# EAGLE design CrackberryPi_1.0.6.2_kb (EAGLE 7.2.0)
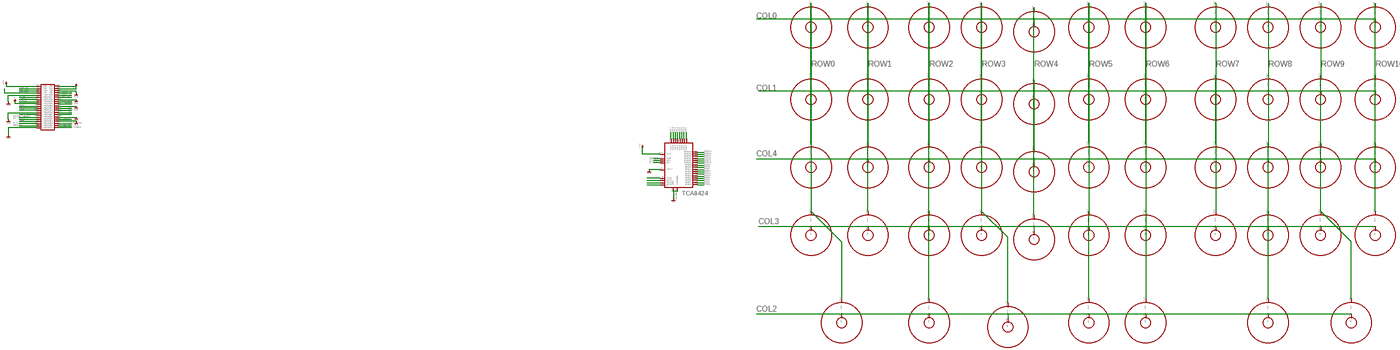
[diagram p0: schematic, sheet 1, overview]
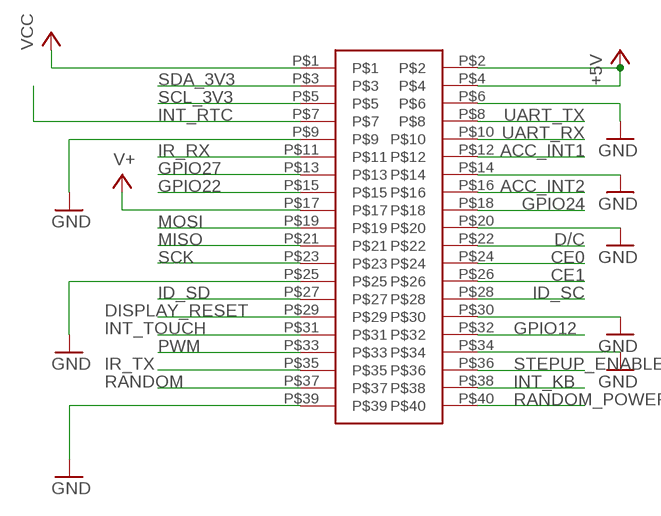
[diagram p1: schematic, sheet 1, part 1 of 4]
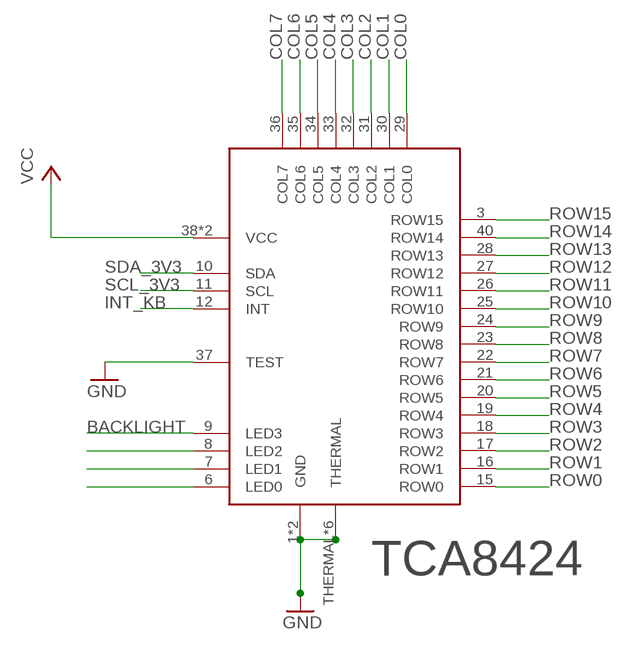
[diagram p2: schematic, sheet 1, part 2 of 4]
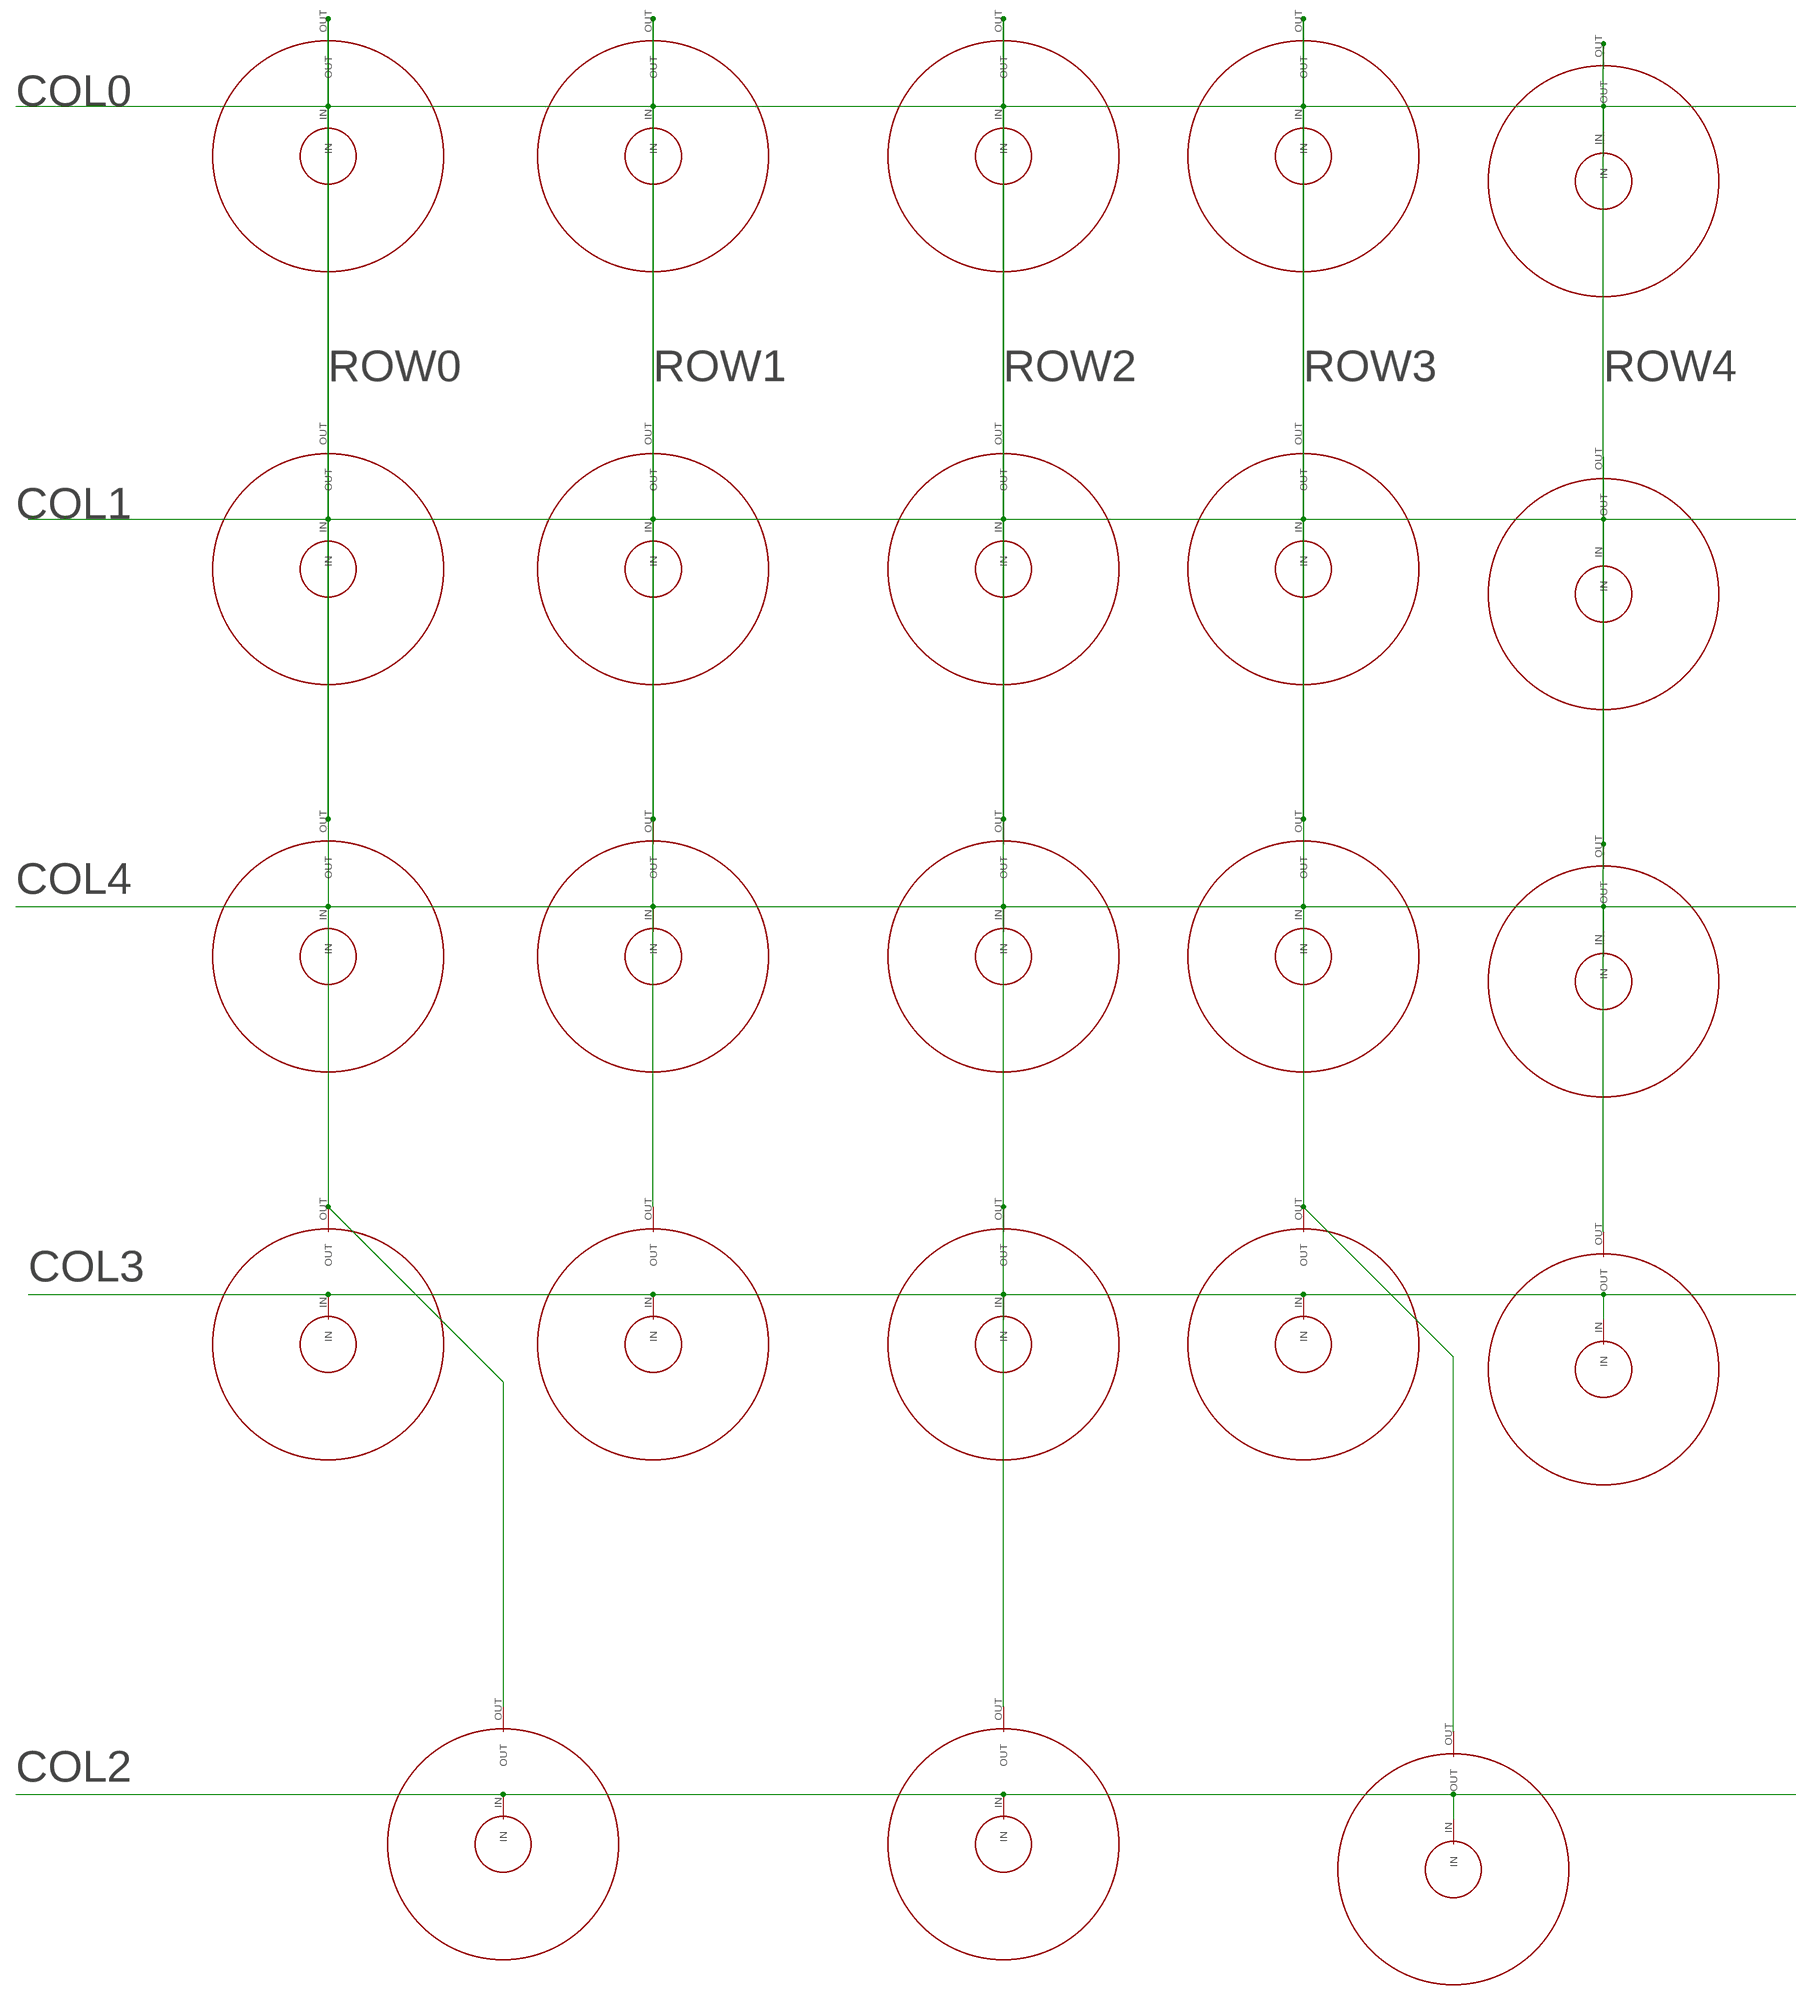
[diagram p3: schematic, sheet 1, part 3 of 4]
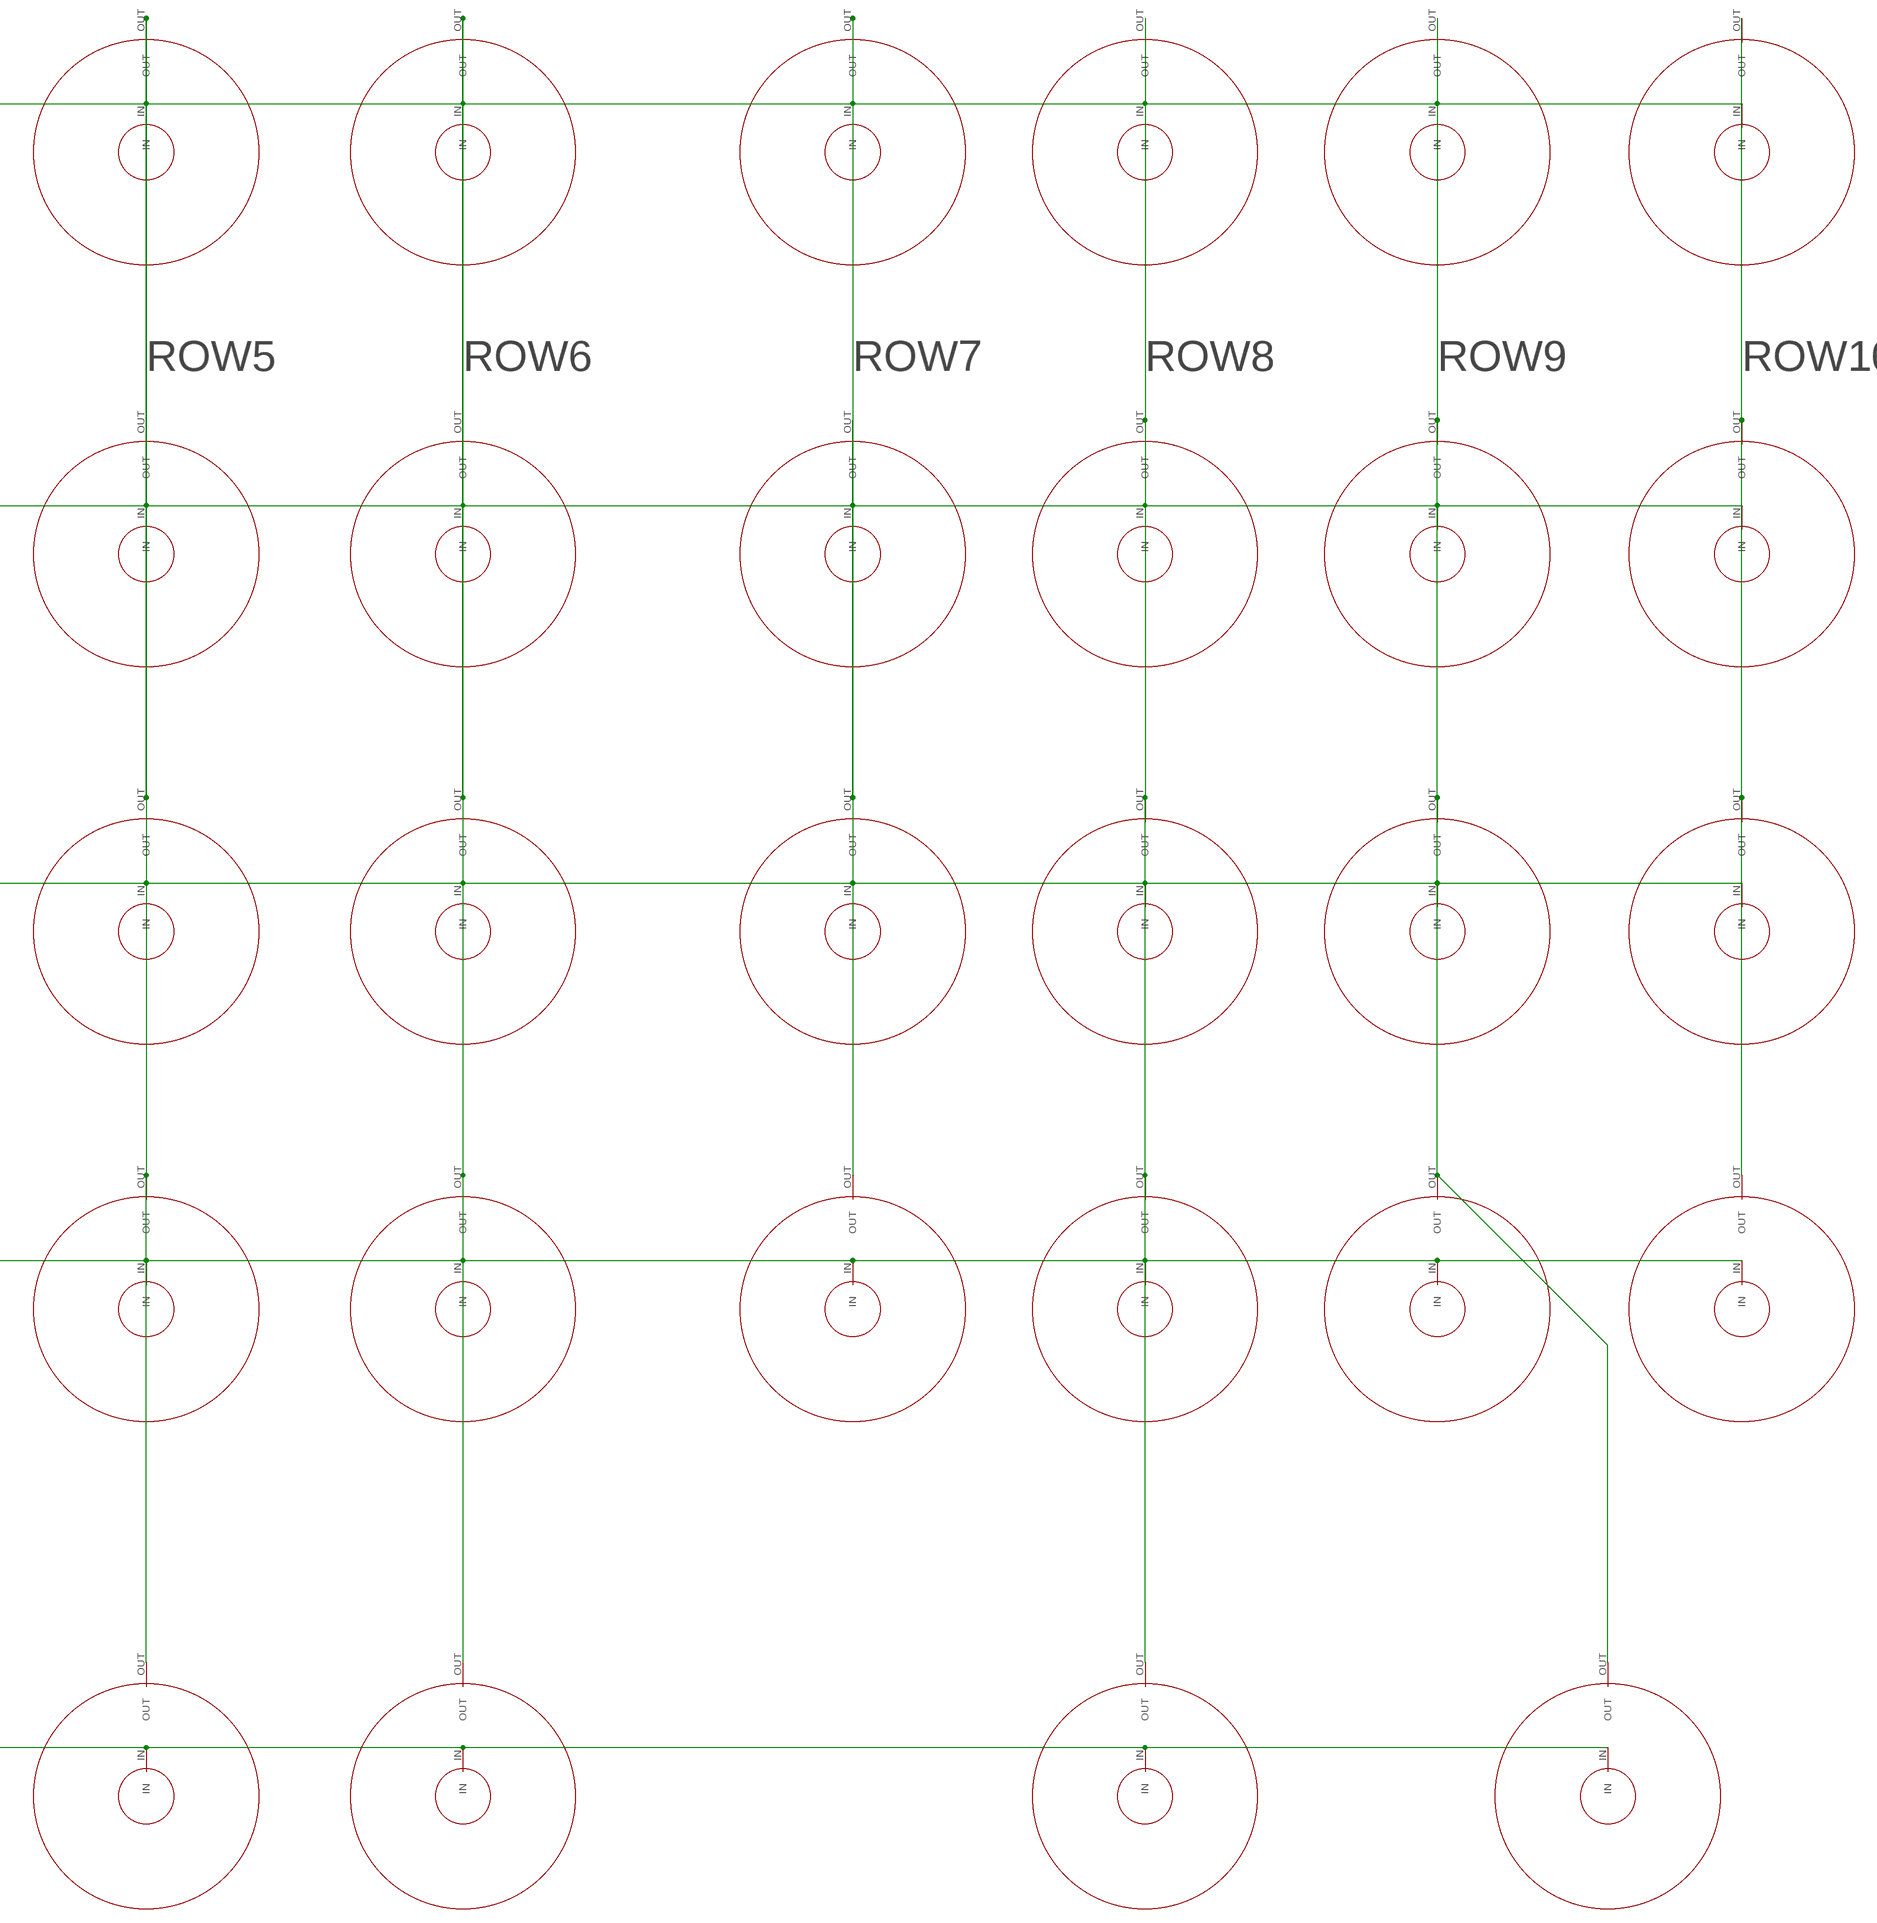
[diagram p4: schematic, sheet 1, part 4 of 4]

## Parts
1  DOME  [4MM]
2  DOME  [4MM]
3  DOME  [4MM]
4  DOME  [4MM]
5  DOME  [4MM]
6  DOME  [4MM]
7  DOME  [4MM]
8  DOME  [4MM]
9  DOME  [4MM]
10  DOME  [4MM]
11  DOME  [4MM]
12  DOME  [4MM]
!  DOME  [4MM]
(  DOME  [4MM]
)  DOME  [4MM]
,  DOME  [4MM]
.  DOME  [4MM]
?  DOME  [4MM]
@  DOME  [4MM]
A  DOME  [4MM]
B  DOME  [4MM]
C  DOME  [4MM]
D  DOME  [4MM]
E  DOME  [4MM]
F  DOME  [4MM]
FN-RIGHT  DOME  [4MM]
G  DOME  [4MM]
H  DOME  [4MM]
I  DOME  [4MM]
J  DOME  [4MM]
K  DOME  [4MM]
L  DOME  [4MM]
M  DOME  [4MM]
N  DOME  [4MM]
O  DOME  [4MM]
P  DOME  [4MM]
Q  DOME  [4MM]
R  DOME  [4MM]
S  DOME  [4MM]
SHIFT-RIGHT  DOME  [4MM]
SHILFT-LEFT  DOME  [4MM]
SPACE1  DOME  [4MM]
SPACE2  DOME  [4MM]
SPACE3  DOME  [4MM]
T  DOME  [4MM]
U  DOME  [4MM]
U$7  TCA8424  [QFN40]
U$11  HEADER  [20X2]
V  DOME  [4MM]
W  DOME  [4MM]
X  DOME  [4MM]
Y  DOME  [4MM]
Z  DOME  [4MM]

## Nets
+5V: U$11.P$2 U$11.P$4
ACC_INT1: U$11.P$12
ACC_INT2: U$11.P$16
BACKLIGHT: U$7.9(LED3)
CE0: U$11.P$24
CE1: U$11.P$26
COL0: 1.IN 2.IN 3.IN 4.IN 5.IN 6.IN 7.IN 8.IN 9.IN 10.IN 11.IN U$7.29(COL0)
COL1: 12.IN E.IN I.IN O.IN P.IN Q.IN R.IN T.IN U$7.30(COL1) U.IN W.IN Y.IN
COL2: @.IN FN-RIGHT.IN SHIFT-RIGHT.IN SHILFT-LEFT.IN SPACE1.IN SPACE2.IN SPACE3.IN U$7.31(COL2)
COL3: !.IN ,.IN ..IN ?.IN B.IN C.IN M.IN N.IN U$7.32(COL3) V.IN X.IN Z.IN
COL4: (.IN ).IN A.IN D.IN F.IN G.IN H.IN J.IN K.IN L.IN S.IN U$7.33(COL4)
COL5: U$7.34(COL5)
COL6: U$7.35(COL6)
COL7: U$7.36(COL7)
D/C: U$11.P$22
DISPLAY_RESET: U$11.P$29
GND: U$7.1(GND) U$7.4(GND) U$7.37(TEST) U$7.THERMAL U$7.VIA1(THERMAL) U$7.VIA2(THERMAL) U$7.VIA3(THERMAL) U$7.VIA4(THERMAL) U$7.VIA5(THERMAL) U$11.P$6 U$11.P$9 U$11.P$14 U$11.P$20 U$11.P$25 U$11.P$30 U$11.P$34 U$11.P$39
GPIO12: U$11.P$32
GPIO22: U$11.P$15
GPIO24: U$11.P$18
GPIO27: U$11.P$13
ID_SC: U$11.P$28
ID_SD: U$11.P$27
INT_KB: U$7.12(INT) U$11.P$38
INT_RTC: U$11.P$7
INT_TOUCH: U$11.P$31
IR_RX: U$11.P$11
IR_TX: U$11.P$35
MISO: U$11.P$21
MOSI: U$11.P$19
N$10: U$7.6(LED0)
N$14: U$7.7(LED1)
N$18: U$7.8(LED2)
PWM: U$11.P$33
RANDOM: U$11.P$37
RANDOM_POWER: U$11.P$40
ROW0: 1.OUT A.OUT Q.OUT SHILFT-LEFT.OUT U$7.15(ROW0) Z.OUT
ROW1: 2.OUT S.OUT U$7.16(ROW1) W.OUT X.OUT
ROW2: 3.OUT C.OUT D.OUT E.OUT SPACE1.OUT U$7.17(ROW2)
ROW3: 4.OUT F.OUT R.OUT SPACE2.OUT U$7.18(ROW3) V.OUT
ROW4: 5.OUT B.OUT G.OUT T.OUT U$7.19(ROW4)
ROW5: 6.OUT H.OUT N.OUT SPACE3.OUT U$7.20(ROW5) Y.OUT
ROW6: 7.OUT J.OUT M.OUT SHIFT-RIGHT.OUT U$7.21(ROW6) U.OUT
ROW7: 8.OUT ?.OUT I.OUT K.OUT U$7.22(ROW7)
ROW8: 9.OUT !.OUT @.OUT L.OUT O.OUT U$7.23(ROW8)
ROW9: 10.OUT (.OUT ,.OUT FN-RIGHT.OUT P.OUT U$7.24(ROW9)
ROW10: 11.OUT 12.OUT ).OUT ..OUT U$7.25(ROW10)
ROW11: U$7.26(ROW11)
ROW12: U$7.27(ROW12)
ROW13: U$7.28(ROW13)
ROW14: U$7.40(ROW14)
ROW15: U$7.3(ROW15)
SCK: U$11.P$23
SCL_3V3: U$7.11(SCL) U$11.P$5
SDA_3V3: U$7.10(SDA) U$11.P$3
STEPUP_ENABLE: U$11.P$36
UART_RX: U$11.P$10
UART_TX: U$11.P$8
V+: U$11.P$17
VCC: U$7.38(VCC) U$7.39(VCC) U$11.P$1

## Notes on the sheet
- TCA8424

## Library data of the parts
1-12 ! ( ) , . ? @ A B C D E F FN-RIGHT G H I J K L M N O P Q R S SHIFT-RIGHT SHILFT-LEFT SPACE1-SPACE3 T U V W X Y Z = DOME:DOME
U$7 = TCA8424:TCA8424
U$11 = 20x2_cirqoid:HEADER

## Board
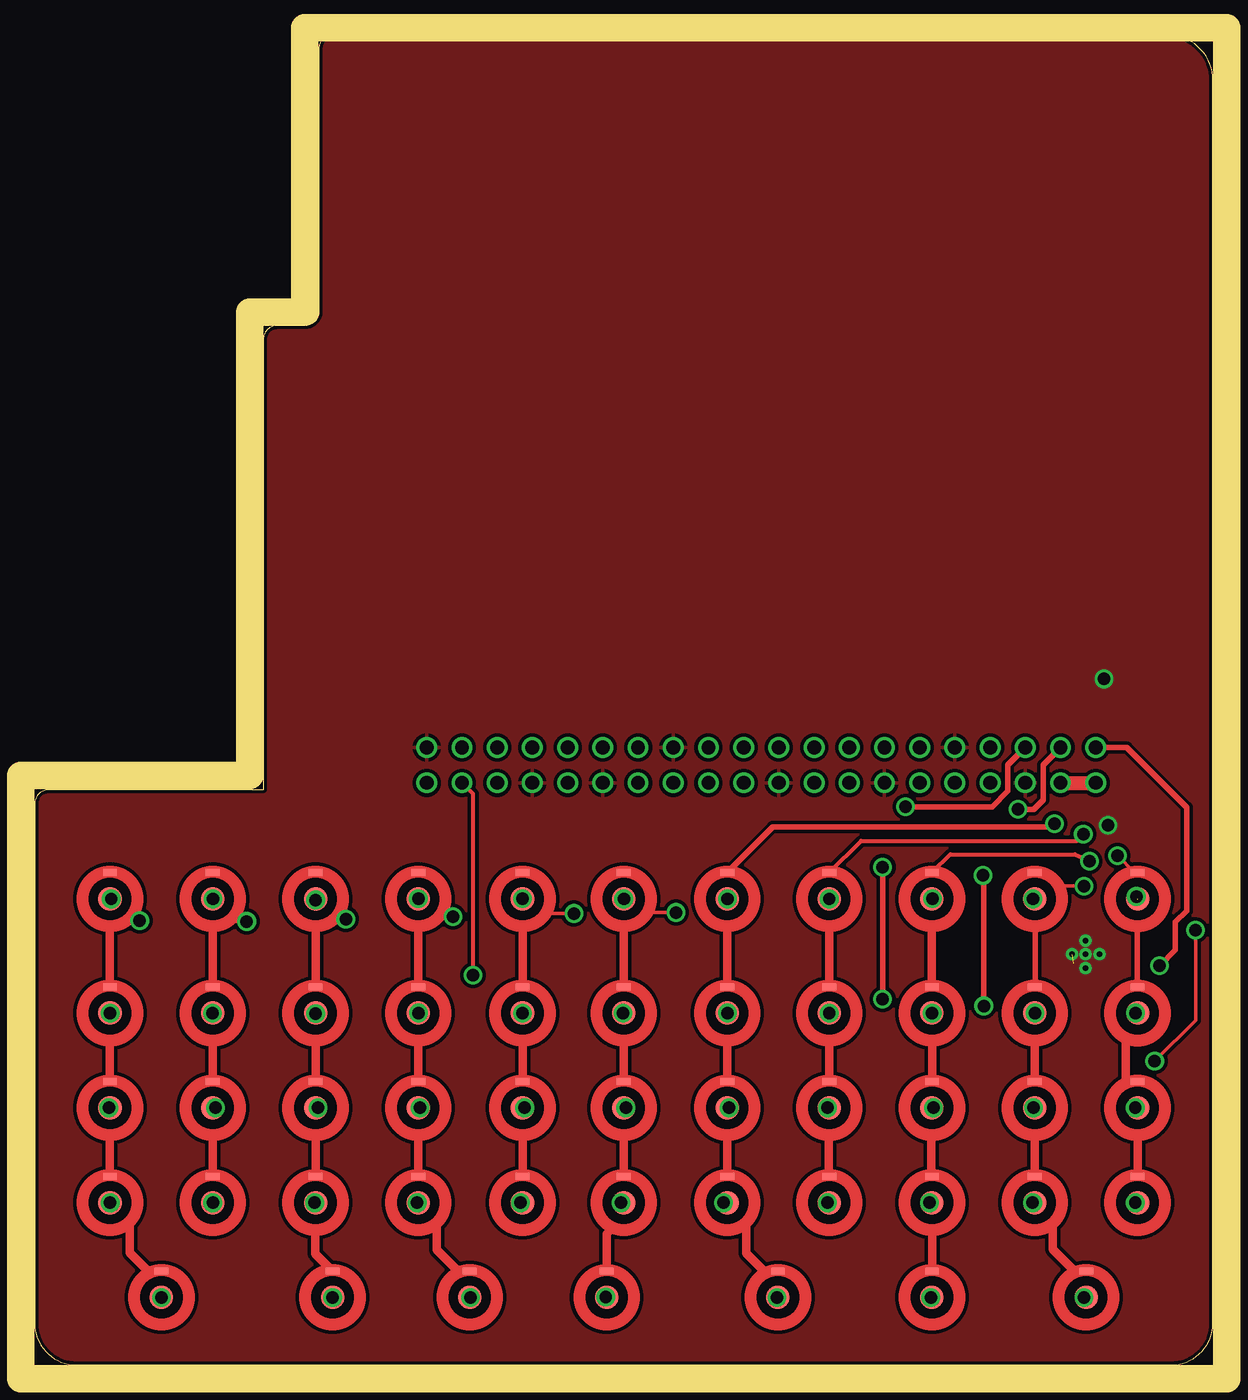
[diagram p5: board, top side]
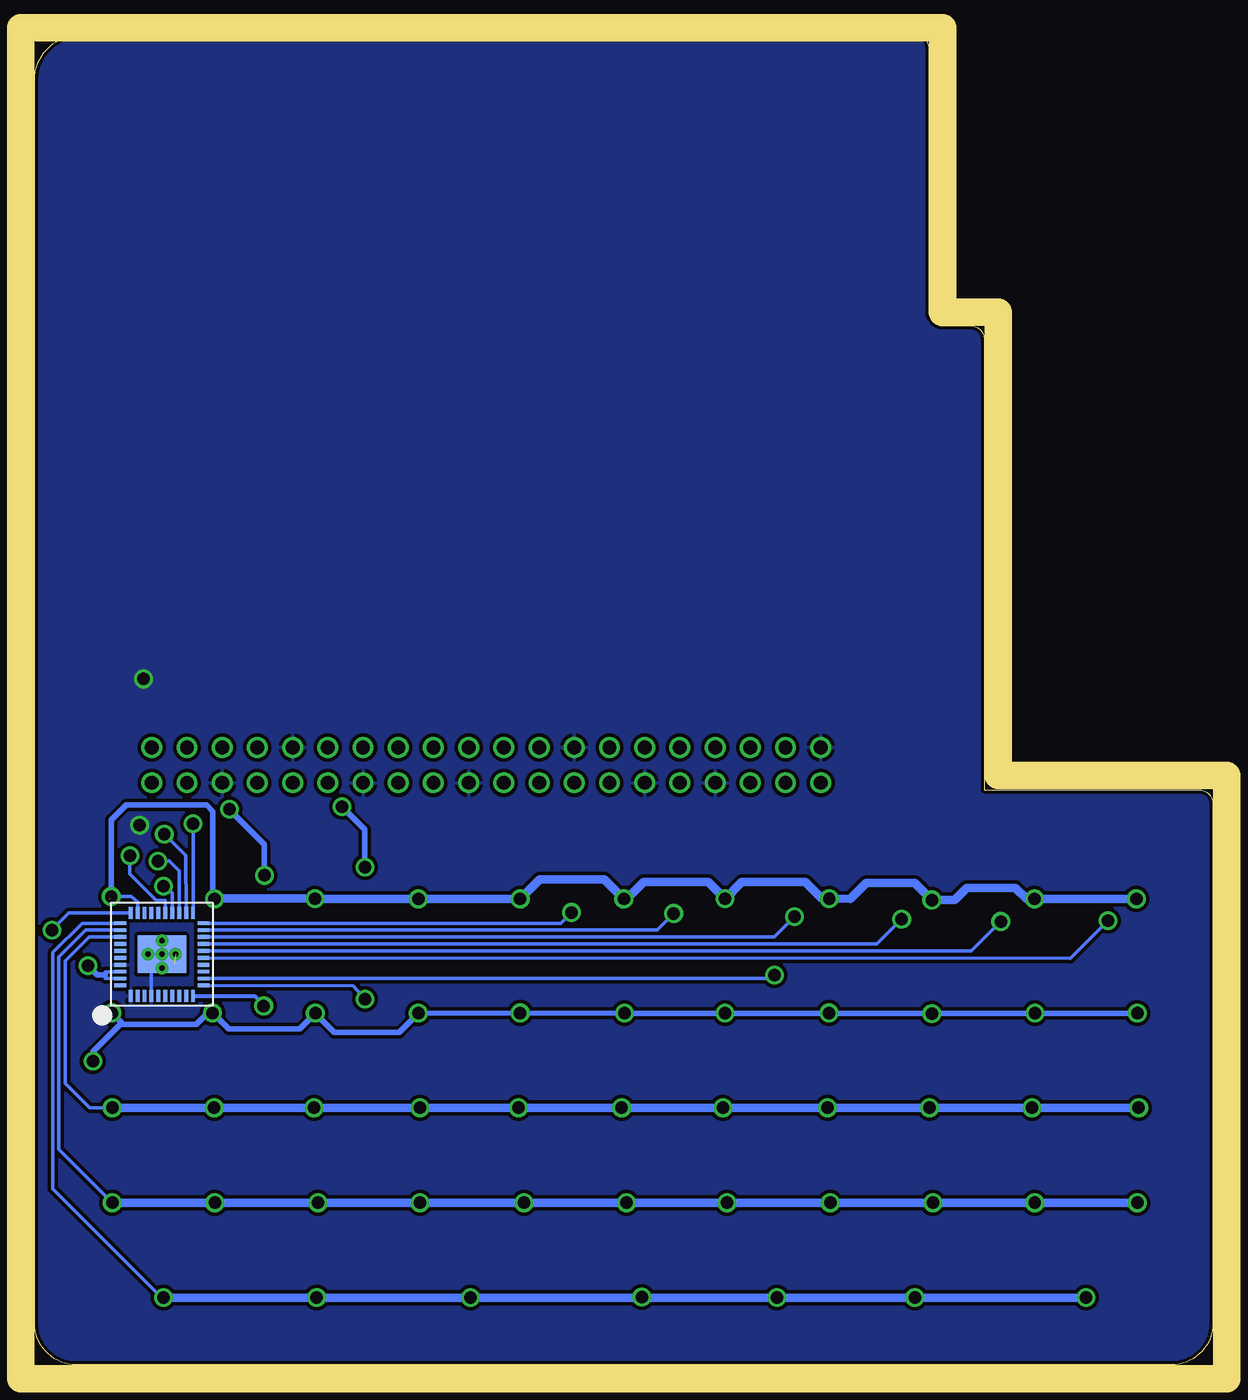
[diagram p6: board, bottom side, seen from below]

Size 85 x 96 mm. Coordinates in mm from the lower left corner, seen from the top.
Outline: 16.5,41.5 1,41.5 arc90 0,40.5 0,3 arc90 3,0 82,0 arc90 85,3 85,92.7 arc90 81.7,96 21.5,96 arc90 20.5,95 20.5,76 arc-90 19.5,75 17.5,75 arc90 16.5,74 16.5,41.5
Copper layers (1*16): Top 0.035mm / dielectric 1.5mm / Bottom 0.035mm
Design rules "SeeedStudio_2layer_DRU_no_angle_20140221": minimum track width 6mil, minimum drill 12mil, track to track 6mil, track to pad 6mil, pad to pad 6mil, via to via 6mil, smd to smd 0mil, copper to edge 10mil, drill to drill 10mil, minimum pad ring 10mil, minimum via ring 6mil, stop-mask expansion 2mil, vias tented up to drill 100mil, thermal gap 10mil
Milling: 8 lines

### Footprints (pad centres in the part's own frame; a part is rotated, then mirrored left to right if it is on the bottom)
4MM = smd 1.7 x 1.7: IN 0,0 | smd 1 x 0.5: OUT 0,1.9
QFN40 = smd 0.85 x 0.28: 1 -3,2.25; 2 -3,1.75; 3 -3,1.25; 4 -3,0.75; 5 -3,0.25; 6 -3,-0.25; 7 -3,-0.75; 8 -3,-1.25; 9 -3,-1.75; 10 -3,-2.25; 21 3,-2.25; 22 3,-1.75; 23 3,-1.25; 24 3,-0.75; 25 3,-0.25; 26 3,0.25; 27 3,0.75; 28 3,1.25; 29 3,1.75; 30 3,2.25 | smd 0.28 x 0.85: 11 -2.25,-3; 12 -1.75,-3; 13 -1.25,-3; 14 -0.75,-3; 15 -0.25,-3; 16 0.25,-3; 17 0.75,-3; 18 1.25,-3; 19 1.75,-3; 20 2.25,-3; 31 2.25,3; 32 1.75,3; 33 1.25,3; 34 0.75,3; 35 0.25,3; 36 -0.25,3; 37 -0.75,3; 38 -1.25,3; 39 -1.75,3; 40 -2.25,3 | smd 2.7 x 3.5: P$2 0,0 | smd 1 x 1.5: P$11 -0.65,0.9; P$12 0.65,0.9; P$13 0.65,-0.9; THERMAL -0.65,-0.9 | drill 0.4 pad 0.406: VIA1 0,1; VIA2 -1,0; VIA3 0,0; VIA4 1,0; VIA5 0,-1
20X2 = drill 1: P$1 0,0; P$2 0,2.54; P$3 2.54,0; P$4 2.54,2.54; P$5 5.08,0; P$6 5.08,2.54; P$7 7.62,0; P$8 7.62,2.54; P$9 10.16,0; P$10 10.16,2.54; P$11 12.7,0; P$12 12.7,2.54; P$13 15.24,0; P$14 15.24,2.54; P$15 17.78,0; P$16 17.78,2.54; P$17 20.32,0; P$18 20.32,2.54; P$19 22.86,0; P$20 22.86,2.54; P$21 25.4,0; P$22 25.4,2.54; P$23 27.94,0; P$24 27.94,2.54; P$25 30.48,0; P$26 30.48,2.54; P$27 33.02,0; P$28 33.02,2.54; P$29 35.56,0; P$30 35.56,2.54; P$31 38.1,0; P$32 38.1,2.54; P$33 40.64,0; P$34 40.64,2.54; P$35 43.18,0; P$36 43.18,2.54; P$37 45.72,0; P$38 45.72,2.54; P$39 48.26,0; P$40 48.26,2.54

### Placement (x,y rotation side)
1  5.43,33.63 0 top
2  12.86,33.63 0 top
3  20.27,33.63 0 top
4  27.68,33.63 0 top
5  35.2,33.63 0 top
6  42.51,33.63 0 top
7  49.97,33.63 0 top
8  57.33,33.63 0 top
9  64.73,33.63 0 top
10  72.16,33.63 0 top
11  79.56,33.63 0 top
12  79.56,25.39 0 top
!  64.73,11.71 0 top
(  72.16,18.55 0 top
)  79.56,18.55 0 top
,  72.16,11.71 0 top
.  79.56,11.71 0 top
?  57.33,11.71 0 top
@  64.73,4.87 0 top
A  5.43,18.55 0 top
B  35.2,11.71 0 top
C  20.27,11.71 0 top
D  20.27,18.55 0 top
E  20.27,25.39 0 top
F  27.68,18.55 0 top
FN-RIGHT  75.86,4.87 0 top
G  35.2,18.55 0 top
H  42.51,18.55 0 top
I  57.33,25.39 0 top
J  49.97,18.55 0 top
K  57.33,18.55 0 top
L  64.73,18.55 0 top
M  49.97,11.71 0 top
N  42.51,11.71 0 top
O  64.73,25.39 0 top
P  72.16,25.39 0 top
Q  5.43,25.39 0 top
R  27.68,25.39 0 top
S  12.86,18.55 0 top
SHIFT-RIGHT  53.62,4.87 0 top
SHILFT-LEFT  9.14,4.87 0 top
SPACE1  21.5,4.87 0 top
SPACE2  31.39,4.87 0 top
SPACE3  41.27,4.87 0 top
T  35.2,25.39 0 top
U  49.97,25.39 0 top
U$7  75.83,29.62 90 bottom
U$11  76.55,44.55 180 top
V  27.68,11.71 0 top
W  12.86,25.39 0 top
X  12.86,11.71 0 top
Y  42.51,25.39 0 top
Z  5.43,11.71 0 top

### Tracks (layer width: path | path; a pad name or v marks a point on that pad's centre or on a via)
+5V
  Top 1.016: U$11.P$4 U$11.P$2
COL0  (via drill 0.9)  (1 unrouted)
  Top 0.254: 12.85,33.65 12.84,33.65 2.IN | 4.IN 27.42,33.63 v27.68,33.65 | 5.IN 34.97,33.63 v35.2,33.65 | 6.IN 42.27,33.63 v42.5,33.62 | 7.IN 49.67,33.63 v49.98,33.62 | 8.IN 57.18,33.63 v57.33,33.62 | 9.IN 64.52,33.63 v64.78,33.65
  Top 0.61: 10.IN arc-90 10.IN v72.03,33.62 | 11.IN v79.47,33.8 | 3.IN v20.27,33.56 v20.27,33.55 | 1.IN v5.52,33.63 v5.53,33.62 | v12.88,33.62 12.9,33.62 2.IN
  Bottom 0.254: 28.2,33.65 27.7,33.65 | 27.7,33.65 4.IN 27.42,33.63 v27.68,33.65 27.7,33.65 | 42.52,33.65 6.IN 42.27,33.63 v42.5,33.62 | 57.34,33.65 8.IN 57.18,33.63 v57.33,33.62 | 64.69,33.63 64.52,33.63 v64.78,33.65 64.55,33.63 9.IN | U$7.29 77.58,33.4 78.03,33.8 v79.47,33.8
  Bottom 0.406: 10.IN 72.16,39.95 72.15,39.95 72.6,40.4 78.4,40.4 79.47,39.33 v79.47,33.8
  Bottom 0.61: 27.65,33.65 v27.68,33.65 | v27.68,33.65 28.2,33.65 29.4,34.85 33.98,34.85 5.IN v35.2,33.65 36.4,34.85 41.05,34.85 42.27,33.63 | v72.03,33.62 arc90 72,33.65 | 72,33.65 v64.78,33.65 | v79.47,33.8 arc90 79.44,33.63 | 10.IN arc90 72.14,33.65 72,33.65 | v27.68,33.65 26.15,33.62 25,34.77 21.5,34.77 v20.27,33.55 18.62,33.55 17.75,34.42 14.24,34.42 13.44,33.62 v12.88,33.62 v5.53,33.62 | 57.34,33.65 57.34,33.63 9.IN | 57.18,33.63 v49.98,33.63 arc90 v49.98,33.62 48.58,35.02 43.9,35.02 v42.5,33.62
COL1  (via drill 0.9)
  Top 0.254: v12.82,25.38 W.IN | E.IN 20.3,24.99 20.3,25.05 | 27.55,25.39 R.IN 27.7,25.02 v27.7,25.4 | 27.55,25.39 v27.7,25.4 | T.IN 35.05,25.39 v35.2,25.38 | 20.1,25 v20.27,25.35 | v20.27,25.35 20.3,25.05 | 20.3,25.05 20.35,25 v20.27,25.35 | 27.55,25.39 27.6,25.34 27.6,25 v27.7,25.4 | 12.IN 79.44,25.39 v79.42,25.4 | v80.8,21.93 83.75,24.88 v83.75,31.38
  Top 0.406: Y.IN v42.45,25.38 | U.IN 50,25.36 v49.98,25.4 | I.IN v57.33,25.38 | O.IN v64.75,25.38 64.78,25.35 | P.IN v72.17,25.4
  Top 1.016: Q.IN 5.54,25.39 v5.45,25.38
  Bottom 0.254: v12.82,25.38 W.IN | T.IN 35.05,25.39 v35.2,25.38 | U$7.30 82.53,32.62 v83.75,31.38
  Bottom 0.406: v72.17,25.4 P.IN | P.IN 72.12,25.38 71,24.25 65.88,24.25 v64.75,25.38 63.38,24 58.7,24 v57.33,25.38 57.12,25.38 v49.98,25.4 49.9,25.4 v42.45,25.38 v35.2,25.38 27.73,25.38 v27.7,25.4 27.56,25.4 27.51,25.35 v20.27,25.35 12.85,25.35 v12.82,25.38 v5.45,25.38 | P.IN v72.17,25.4 72.5,25.4 73.33,24.57 78.6,24.57 78.7,24.68 | 78.7,24.68 v79.42,25.4 | v80.8,21.93 80.8,22.57 78.7,24.68
COL2  (via drill 0.9)
  Top 0.254: SHILFT-LEFT.IN 9.28,4.87 arc-90 v9.15,4.85 | v21.5,4.85 21.52,4.85 SPACE1.IN | SPACE2.IN 31.27,4.87 v31.45,4.85 | SPACE3.IN 41.23,4.87 v41.2,4.9 | SHIFT-RIGHT.IN 53.57,4.87 v53.55,4.85 | @.IN 64.67,4.87 v64.65,4.85 | FN-RIGHT.IN 75.72,4.87 v75.7,4.85
  Bottom 0.254: v21.5,4.85 v31.45,4.85 31.43,4.87 SPACE2.IN 31.41,4.9 v41.2,4.9 41.25,4.85 v53.55,4.85 v64.65,4.85 v75.7,4.85 75.72,4.87 FN-RIGHT.IN 83.7,12.71 83.7,29.75 81.58,31.88 U$7.31 | 16.52,4.85 16.52,4.9 16.57,4.85
  Bottom 0.61: v9.15,4.85 16.57,4.85 v75.7,4.85
COL3  (via drill 0.9)
  Top 0.254: Z.IN 5.25,11.7 v5.45,11.7 | v12.85,11.7 13.49,11.71 X.IN | C.IN 20.25,11.7 v20.2,11.7 | V.IN 27.66,11.7 v27.6,11.7 | B.IN 35.19,11.7 v35.05,11.7 | N.IN 42.49,11.7 v42.3,11.7 | M.IN 49.95,11.7 v49.7,11.7 | ?.IN v57.2,11.71 v57.2,11.7 | !.IN v64.55,11.71 v64.55,11.7 | ,.IN v72,11.71 v72,11.7 | ..IN v79.4,11.71 v79.4,11.7
  Bottom 0.254: v49.7,11.7 v49.69,11.71 49.15,11.71 | 49.15,11.71 N.IN 42.49,11.7 v42.3,11.7 v35.05,11.7 v35.04,11.71 V.IN 27.66,11.7 v27.6,11.7 v27.59,11.71 C.IN 20.25,11.7 v20.2,11.7 v12.85,11.7 | v57.2,11.7 49.15,11.7 49.15,11.71 | v64.55,11.7 v72,11.7 v79.4,11.7 | ..IN v79.41,11.71 v79.4,11.7 | 9.12,11.7 9.53,11.7 | U$7.32 81.3,31.38 83.25,29.43 83.25,15.55 v79.4,11.7
  Bottom 0.61: v64.55,11.7 v57.2,11.7 | v5.45,11.7 9.53,11.7 v79.4,11.7
COL4  (via drill 0.9)
  Top 0.254: ).IN v79.4,18.55 | v72.05,18.55 (.IN | L.IN v64.85,18.55 | K.IN v57.2,18.55 | J.IN v50.1,18.55 | H.IN v42.65,18.55 | G.IN v35.35,18.55 | F.IN v27.8,18.55 | D.IN v20.45,18.55 | S.IN v13.05,18.55 | A.IN v5.35,18.55
  Bottom 0.254: v13.05,18.55 v20.45,18.55 v27.8,18.55 v35.35,18.55 v42.65,18.55 v50.1,18.55 v57.2,18.55 v64.85,18.55 v72.05,18.55 v79.4,18.55 81.03,18.55 82.8,20.32 82.8,29.15 81.08,30.88 U$7.33
  Bottom 0.61: v5.35,18.55 v79.4,18.55
GND  (via drill 0.9)  (1 unrouted)
  Bottom 0.254: U$7.4 76.58,29.62 U$7.VIA3
  other vias: 77.42,38.95 77.15,49.5
  pour Bottom (isolate 0.254, rank 6): 16.5,41.5 1,41.5 arc90 0,40.5 0,3 arc90 3,0 82,0 arc90 85.15,3.1 85.15,92.7 arc90 81.6,96 21.41,96 arc90 20.5,94.84 20.5,76.02 arc-90 19.48,75 17.5,75 arc90 16.5,74
  pour Top (isolate 0.254, rank 6): 16.5,41.5 1,41.5 arc90 0,40.5 0,3 arc90 3,0 82,0 arc90 85.12,3.23 85.12,92.83 arc90 81.6,96 21.5,96 arc90 20.5,95 20.5,76 arc-90 19.5,75 17.5,75 arc90 16.5,74
INT_KB  (via drill 0.9)
  Top 0.305: v31.62,28.12 31.62,41.22 U$11.P$38
  Bottom 0.254: U$7.12 31.88,27.88 v31.62,28.12
ROW0  (via drill 0.9)
  Top 0.254: 6.85,10.35 arc90 7.4,10.9 7.4,11.65 arc90 Z.OUT Z.OUT arc-90 5.4,13.64 | 8.2,6.75 9.12,6.75 SHILFT-LEFT.OUT | 1.OUT 1.OUT arc90 3.5,33.6 arc90 5.45,31.65 5.58,31.77 6.1,31.77 6.4,32.08 v7.58,32.05 | 5.45,27.3 arc-90 Q.OUT 5.34,27.29 arc90 3.45,25.4 3.45,25.3 arc90 5.4,23.35 | 5.4,20.48 arc90 A.OUT 5.3,20.45 arc90 3.4,18.55 3.4,18.4 arc90 5.4,16.4
  Top 0.61: 5.45,31.65 5.43,31.64 Q.OUT | 5.4,23.35 5.43,23.32 A.OUT | 5.4,16.4 5.43,16.36 Z.OUT | 8.2,6.75 6.85,8.1 6.85,10.35
  Bottom 0.254: U$7.15 10.28,29.35 v7.58,32.05
ROW1  (via drill 0.9)
  Top 0.254: 2.OUT 12.73,35.53 arc90 10.85,33.65 10.85,33.55 arc90 12.85,31.55 | W.OUT arc90 W.OUT 12.74,27.29 arc90 10.85,25.4 10.85,25.35 arc90 12.9,23.3 | 12.9,20.5 arc-90 S.OUT 12.75,20.45 arc90 10.85,18.55 10.85,18.45 arc90 12.85,16.45 | X.OUT arc90 X.OUT | v15.3,32 13.9,32 13.57,31.68 12.98,31.68 12.86,31.55
  Top 0.61: 12.9,23.3 12.86,23.25 S.OUT | 12.85,31.55 12.86,31.55 W.OUT | 12.85,16.45 12.86,16.45 X.OUT
  Bottom 0.254: U$7.16 17.43,29.88 v15.3,32
ROW2  (via drill 0.9)
  Top 0.254: 20.25,9.65 arc90 22.2,11.6 22.2,11.75 arc90 20.34,13.61 C.OUT arc90 20.3,13.64 | 20.3,16.55 arc-90 18.3,18.55 arc-90 20.2,20.45 D.OUT arc-90 20.25,20.46 | 20.25,23.3 arc-90 18.25,25.3 18.25,25.4 arc-90 20.14,27.29 E.OUT arc-90 20.25,27.3 | 3.OUT 20.18,35.53 arc90 18.3,33.65 18.3,33.5 arc90 20.25,31.55 | v22.45,32.17 21.35,32.17 21.05,31.88 20.61,31.88 20.27,31.54
  Top 0.61: 20.25,31.55 20.27,31.54 E.OUT | 20.25,23.3 20.27,23.29 D.OUT | 20.3,16.55 20.27,16.52 C.OUT | SPACE1.OUT 20.25,8.02 20.25,9.65
  Bottom 0.254: U$7.17 24.25,30.38 v22.45,32.17
ROW3  (via drill 0.9)
  Top 0.254: 4.OUT 27.53,35.53 arc90 25.65,33.65 arc90 27.7,31.6 27.7,31.35 28.15,31.8 28.52,31.8 29.07,32.35 v30.18,32.35 | 27.7,27.32 arc-90 R.OUT 27.59,27.29 arc90 25.7,25.4 25.7,25.2 arc90 27.65,23.25 | 27.65,20.48 arc90 F.OUT 27.6,20.45 arc90 25.7,18.55 25.7,18.45 arc90 27.65,16.5 | 27.65,13.63 arc90 V.OUT 27.79,13.61 arc-90 29.7,11.7 29.7,11.05 arc-90 29,10.35 | 30.55,6.75 31.36,6.75 SPACE2.OUT
  Top 0.61: 27.7,31.35 27.68,31.32 R.OUT | 27.65,16.5 27.68,16.48 V.OUT | 27.65,23.25 27.68,23.23 F.OUT | 30.55,6.75 29,8.3 29,10.35
  Bottom 0.254: v30.18,32.35 31.65,30.88 U$7.18
ROW4  (via drill 0.9)
  Top 0.254: 35.2,16.5 arc-90 33.25,18.45 33.25,18.55 arc-90 35.15,20.45 G.OUT arc90 G.OUT | B.OUT arc-90 B.OUT | 35.2,23.35 arc-90 33.3,25.25 33.3,25.4 arc-90 T.OUT T.OUT arc90 T.OUT | 35.17,35.55 5.OUT 35.03,35.53 arc90 33.15,33.65 33.15,33.55 arc90 35.2,31.5 35.5,31.8 36.12,31.8 36.9,32.58 v38.9,32.58
  Top 0.61: 35.2,31.5 T.OUT | 35.2,23.35 35.2,23.34 G.OUT | 35.2,16.5 B.OUT
  Bottom 0.254: v38.9,32.58 40.1,31.38 U$7.19
ROW5  (via drill 0.9)
  Top 0.254: Y.OUT arc90 Y.OUT 42.49,27.29 arc90 40.6,25.4 40.6,25.3 arc90 42.5,23.4 | H.OUT arc90 H.OUT 42.4,20.45 arc90 40.45,18.5 40.45,18.45 arc90 42.5,16.4 | N.OUT arc90 N.OUT 42.41,13.61 arc90 40.5,11.7 40.5,11.2 arc90 41.75,9.95 | 6.OUT 42.48,35.53 arc90 40.55,33.6 40.55,33.45 arc90 42.5,31.5 42.6,31.6 43.08,31.6 44.12,32.65 v46.27,32.65
  Top 0.61: 42.5,31.5 42.51,31.5 Y.OUT | 42.5,23.4 42.51,23.39 H.OUT | 42.5,16.4 42.51,16.39 N.OUT | SPACE3.OUT 41.27,9.46 41.75,9.95
  Bottom 0.254: U$7.20 47.05,31.88 v46.27,32.65
ROW6  (via drill 0.9)
  Top 0.254: 51.35,10.25 arc90 52,10.9 52,11.7 arc90 50.09,13.61 M.OUT arc-90 49.95,13.62 | 52.65,6.75 53.6,6.75 SHIFT-RIGHT.OUT | 49.95,16.5 arc-90 47.9,18.55 47.9,18.6 arc-90 49.75,20.45 J.OUT arc-90 49.95,20.46 | 49.95,23.4 arc-90 48,25.35 48,25.4 arc-90 49.89,27.29 U.OUT arc90 50,27.32 | 50.45,31.95 50,31.5 arc-90 48,33.5 48,33.6 arc-90 49.93,35.53 7.OUT 49.95,35.55
  Top 0.406: 7.OUT 53.26,38.83 73.35,38.83 v73.58,39.05
  Top 0.61: 50,31.5 49.97,31.46 U.OUT | 49.95,23.4 49.97,23.39 J.OUT | 49.95,16.5 49.97,16.48 M.OUT | 52.65,6.75 51.35,8.05 51.35,10.25
  Bottom 0.254: U$7.21 v73.58,39.05
ROW7  (via drill 0.9)
  Top 0.254: 8.OUT 57.23,35.53 arc90 55.3,33.6 55.3,33.5 arc90 57.3,31.5 57.8,31.5 58.4,32.1 | 57.3,27.32 arc90 I.OUT 57.19,27.29 arc90 55.3,25.4 arc90 57.35,23.35 | 57.35,20.48 arc-90 K.OUT 57.3,20.45 arc90 55.4,18.55 55.4,18.35 arc90 57.3,16.45 | 57.3,13.63 arc90 ?.OUT
  Top 0.305: 8.OUT 59.62,37.83 75.2,37.83 v75.65,38.3
  Top 0.61: 57.3,31.5 57.33,31.48 I.OUT | 57.35,23.35 57.33,23.32 K.OUT | 57.3,13.63 57.3,16.45
  Bottom 0.254: U$7.22 74.1,36.75 v75.65,38.3
ROW8  (via drill 0.9)
  Top 0.254: 64.75,9.65 arc-90 62.7,11.7 arc-90 64.61,13.61 !.OUT arc-90 64.7,13.64 | 64.75,6.79 arc-90 @.OUT | 64.58,35.67 9.OUT
  Top 0.305: 9.OUT 66.06,36.85 75.05,36.85 v76.1,36.35
  Top 0.61: 64.75,6.79 64.75,9.65 | 64.7,13.64 64.7,16.57 arc-90 62.8,18.48 62.8,18.6 arc-90 64.65,20.45 L.OUT arc90 64.75,20.46 64.75,23.35 arc-90 62.75,25.35 62.75,25.55 arc-90 64.49,27.29 O.OUT arc-90 O.OUT 64.72,31.65 arc-90 62.77,33.6 62.77,33.67 arc-90 64.63,35.53 9.OUT arc-90 9.OUT
  Bottom 0.254: U$7.23 74.58,35.65 75.3,36.35 v76.1,36.35
ROW9  (via drill 0.9)
  Top 0.254: 72.2,16.5 arc-90 70.2,18.5 70.2,18.55 arc-90 72.1,20.45 (.OUT arc-90 (.OUT | 72.2,13.65 arc-90 ,.OUT 72.34,13.61 arc-90 74.2,11.75 74.2,11.05 arc-90 73.45,10.3 | 75,6.8 75.83,6.8 FN-RIGHT.OUT | 72.16,23.34 72.15,23.35 arc-90 70.15,25.35 70.15,25.4 arc-90 72.04,27.29 P.OUT | 72.17,31.62 arc-90 70.25,33.55 70.25,33.7 arc-90 72.08,35.53 10.OUT 72.92,35.53 73.88,34.55 v75.7,34.55
  Top 0.406: P.OUT arc90 72.17,27.31 72.17,31.62
  Top 0.61: 72.16,23.34 (.OUT | 72.2,16.5 72.16,16.45 ,.OUT | 75,6.8 73.45,8.35 73.45,10.3
  Bottom 0.254: U$7.24 75.08,34.05 v75.7,34.55
ROW10  (via drill 0.9)
  Top 0.254: 79.56,16.56 79.53,16.6 arc-90 77.6,18.52 77.6,18.65 arc-90 79.4,20.45 ).OUT | 79.58,23.38 arc-90 77.65,25.3 77.65,25.43 arc-90 79.52,27.29 12.OUT | 79.55,31.73 arc90 81.45,33.62 81.45,33.75 arc90 79.67,35.53 11.OUT 79.34,35.53 v78.12,36.75
  Top 0.406: 12.OUT arc-90 79.55,27.3 79.55,31.73
  Top 0.61: ..OUT 79.56,16.56 | ).OUT arc90 79.58,20.46 78.7,20.46 78.7,23.38 79.58,23.38
  Bottom 0.254: U$7.25 75.58,33.52 76.22,33.52 78.12,35.42 v78.12,36.75
SCL_3V3  (via drill 0.9)
  Top 0.406: U$11.P$5 70.2,43.28 70.2,41.4 69.08,40.27 v62.83,40.27 | v61.17,35.92 v61.17,26.4
  Bottom 0.254: 71.45,44.57 U$11.P$5 | U$7.11 62.02,27.35 v61.17,26.4
  Bottom 0.406: v62.83,40.27 61.17,38.62 v61.17,35.92
SDA_3V3  (via drill 0.9)
  Top 0.406: U$11.P$3 72.75,43.29 72.75,40.77 72.08,40.1 v70.95,40.1 71.17,40.1 | v68.42,35.33 68.47,35.27 v68.47,25.9
  Bottom 0.305: U$7.10 69.12,26.62 v68.47,25.9
  Bottom 0.406: v70.95,40.1 68.42,37.58 v68.42,35.33 | 73.95,44.6 U$11.P$3
VCC  (via drill 0.9)
  Top 0.406: v81.15,28.8 82.3,29.95 82.3,31.98 83.1,32.77 83.1,40.23 78.78,44.55 U$11.P$1
  Bottom 0.254: U$7.39 79.92,27.88 79.92,28.12 79.92,28.38 U$7.38
  Bottom 0.406: 79.92,28.12 80.47,28.12 v81.15,28.8